# Altium schematic sheet 08.MCU_OSC.SchDoc
size 297 x 209 mm
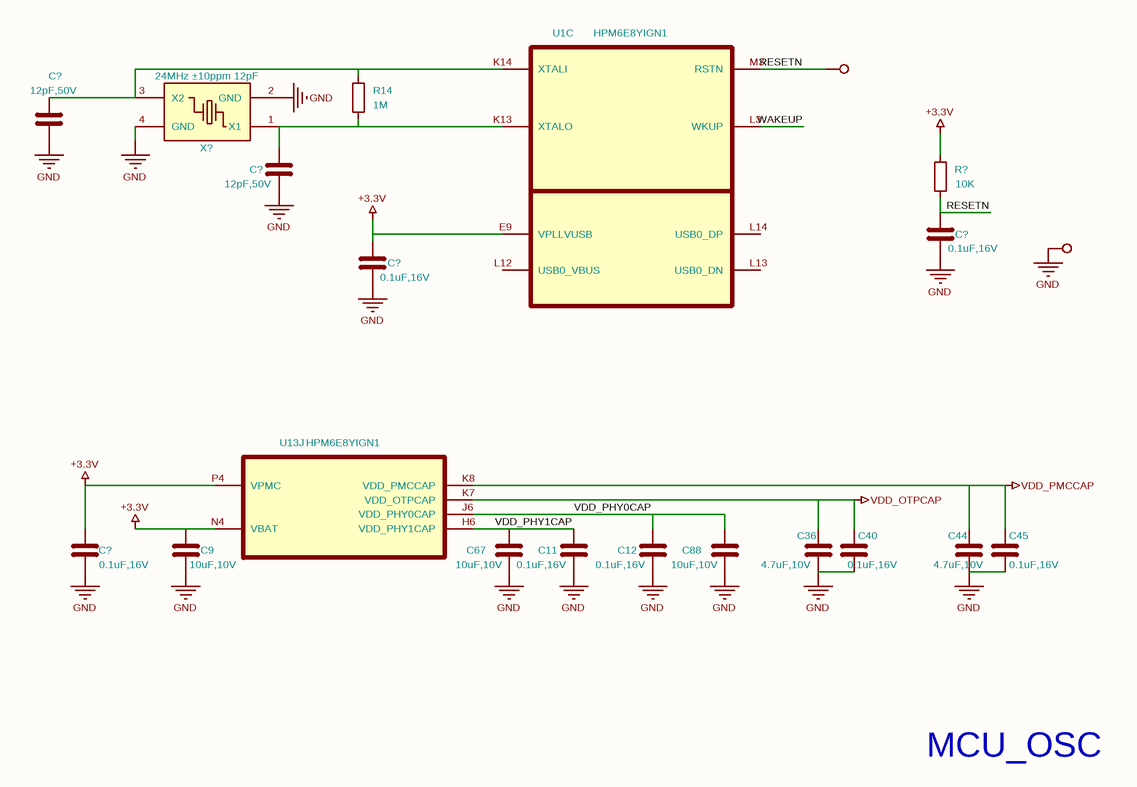
[diagram p0: 08.MCU_OSC.SchDoc]

## Parts
(Parts that share a designator on the sheet are numbered #1, #2 ... from top to bottom, then left to right.)
C9  10uF,10V  [C_0402]
C11  0.1uF,16V  [C_0402]
C12  0.1uF,16V  [C_0402]
C36  4.7uF,10V  [C_0402]
C40  0.1uF,16V  [C_0402]
C44  4.7uF,10V  [C_0402]
C45  0.1uF,16V  [C_0402]
C67  10uF,10V  [C_0402]
C88  10uF,10V  [C_0402]
C?#1  12pF,50V  [C_0402]
C?#2  12pF,50V  [C_0402]
C?#3  0.1uF,16V  [C_0402]
C?#4  0.1uF,16V  [C_0402]
C?#5  0.1uF,16V  [C_0402]
R14  1M  [R_0402_1005Metric]
R?  10K  [R_0402_1005Metric]
TP38#1  1.0mm  [TestPoint_1.5]  (value not drawn)
TP38#2  1.0mm  [TestPoint_1.5]  (value not drawn)
U1  HPM6E8YIGN1  [BGA-196_14x14_12.0x12.0mm_P0.8mm]  (part C of 10)
U13  HPM6E8YIGN1  [BGA-196_14x14_12.0x12.0mm_P0.8mm]  (part J of 10)
X?  24MHz ±10ppm 12pF  [3225]

## Nets
+3.3V: C9.1 C?#4.1 C?#5.2 R?.1 U1.E9(VPLLVUSB) U13.N4(VBAT) U13.P4(VPMC)
GND: C9.2 C11.2 C12.2 C36.2 C40.2 C44.2 C45.2 C67.2 C88.2 C?#1.2 C?#2.2 C?#3.2 C?#4.2 C?#5.1 TP38#2.1 X?.2(GND) X?.4(GND)
VDD_OTPCAP: C36.1 C40.1 U13.K7(VDD_OTPCAP)
VDD_PMCCAP: C44.1 C45.1 U13.K8(VDD_PMCCAP)
RESETN: C?#3.1 R?.2 TP38#1.1 U1.M3(RSTN)
VDD_PHY0CAP: C12.1 C88.1 U13.J6(VDD_PHY0CAP)
VDD_PHY1CAP: C11.1 C67.1 U13.H6(VDD_PHY1CAP)
WAKEUP: U1.L3(WKUP)
NetC?#1_1: C?#1.1 R14.2 U1.K14(XTALI) X?.3(X2)
NetC?#2_1: C?#2.1 R14.1 U1.K13(XTALO) X?.1(X1)

Not connected (* = marked no-connect by the designer): U1 L12(USB0_VBUS) L13(USB0_DN) L14(USB0_DP)

## Notes on the sheet
- MCU_OSC
- 1
- 2
- 3
- 4
- 5
- 6
- A
- B
- C
- D
- Title: HPM6E8Y_RbMotor_ECAT
- File: 08.MCU_OSC.kicad_sch
- Sheet: /
- KiCad E.D.A.  kicad (5.1.4)-1
- Size: A4
- Date: 2023-12-28
- Rev: RevB+
- Id: 1/1

## Library data of the parts
C9 C67 C88 = 10uF,10V_0402: Model: CL05A106MP5NUNC; Company: SAMSUNG(三星); Value: 10uF,10V; Footprint: 03_HPM_Capacitance:C_0402
C11 = 0.1uF,16V_0402_2: Model: CL05B104KO5NNNC; Company: SAMSUNG(三星); Value: 0.1uF,16V; Footprint: 03_HPM_Capacitance:C_0402
C12 C?#3 = 0.1uF,16V_0402_1: Model: CL05B104KO5NNNC; Company: SAMSUNG(三星); Value: 0.1uF,16V; Footprint: 03_HPM_Capacitance:C_0402
C36 = 4.7uF,10V_0402: Model: CL05A475MP5NRNC; Company: SAMSUNG(三星); Value: 4.7uF,10V; Footprint: 03_HPM_Capacitance:C_0402
C40 = 0.1uF,16V_0402_4: Model: CL05B104KO5NNNC; Company: SAMSUNG(三星); Value: 0.1uF,16V; Footprint: 03_HPM_Capacitance:C_0402
C44 = 4.7uF,10V_0402_1: Model: CL05A475MP5NRNC; Company: SAMSUNG(三星); Value: 4.7uF,10V; Footprint: 03_HPM_Capacitance:C_0402
C45 = 0.1uF,16V_0402_5: Model: CL05B104KO5NNNC; Company: SAMSUNG(三星); Value: 0.1uF,16V; Footprint: 03_HPM_Capacitance:C_0402
C?#1 = 12pF,50V_0402_1: Model: CC0402JRNPO9BN120; Company: YAGEO(国巨); Value: 12pF,50V; Footprint: 03_HPM_Capacitance:C_0402
C?#2 = 12pF,50V_0402: Model: CC0402JRNPO9BN120; Company: YAGEO(国巨); Value: 12pF,50V; Footprint: 03_HPM_Capacitance:C_0402
C?#4 = 0.1uF,16V_0402_3: Model: CL05B104KO5NNNC; Company: SAMSUNG(三星); Value: 0.1uF,16V; Footprint: 03_HPM_Capacitance:C_0402
C?#5 = 0.1uF,16V_0402: Model: CL05B104KO5NNNC; Company: SAMSUNG(三星); Value: 0.1uF,16V; Footprint: 03_HPM_Capacitance:C_0402
R14 = 1M_0402: Model: CQ02WGJ0105TCE; Company: UNI-ROYAL(厚声); Value: 1M; Footprint: 02_HPM_Resistor:R_0402_1005Metric
R? = 10K_0402: Model: 0402WGF1002TCE; Company: UNI-ROYAL(厚声); Value: 10K; Footprint: 02_HPM_Resistor:R_0402_1005Metric
TP38#1 TP38#2 = TestPoint-1.0mm: Value: 1.0mm; Footprint: 01_HPM_Peripheral:TestPoint_1.5
X? = 24MHz ±10ppm 12pF: Model: X1E0000210129; Company: EPSON(爱普生); Value: 24MHz ±10ppm 12pF; Footprint: 09_HPM_Oscillator:3225
U1 U13 = HPM6E8YIGN1: Value: HPM6E8YIGN1; Footprint: 00_HPM_Library:BGA-196_14x14_12.0x12.0mm_P0.8mm